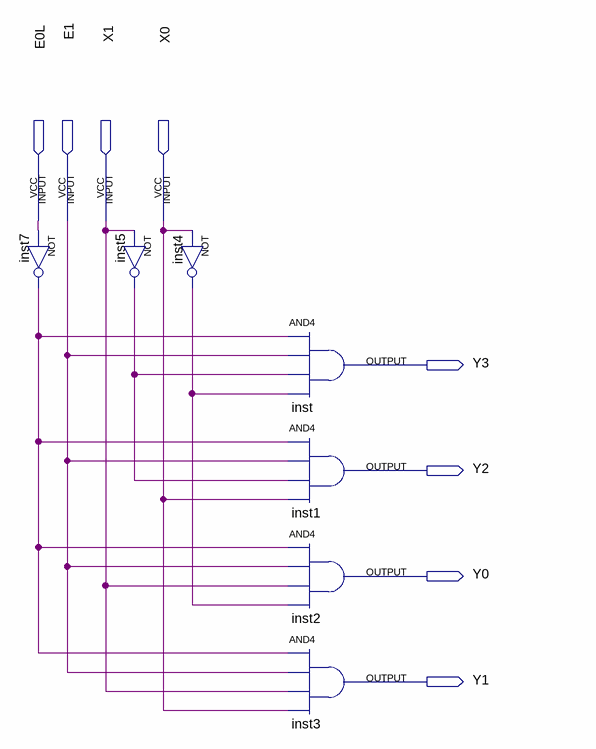
[diagram p0: schematic sheet]
// Quartus schematic Dec2_4.bdf as structural Verilog: 7 symbols, 8 pins
module Dec2_4 (
  input  E0L,
  input  E1,
  input  X1,
  input  X0,
  output Y3,
  output Y2,
  output Y0,
  output Y1
);

  wire inst4_out, inst5_out, inst7_out;

  not inst7 (inst7_out, E0L);
  not inst5 (inst5_out, X1);
  not inst4 (inst4_out, X0);
  and inst (Y3, inst7_out, E1, inst5_out, inst4_out);
  and inst1 (Y2, inst7_out, E1, inst5_out, X0);
  and inst2 (Y0, inst7_out, E1, X1, inst4_out);
  and inst3 (Y1, inst7_out, E1, X1, X0);
endmodule
